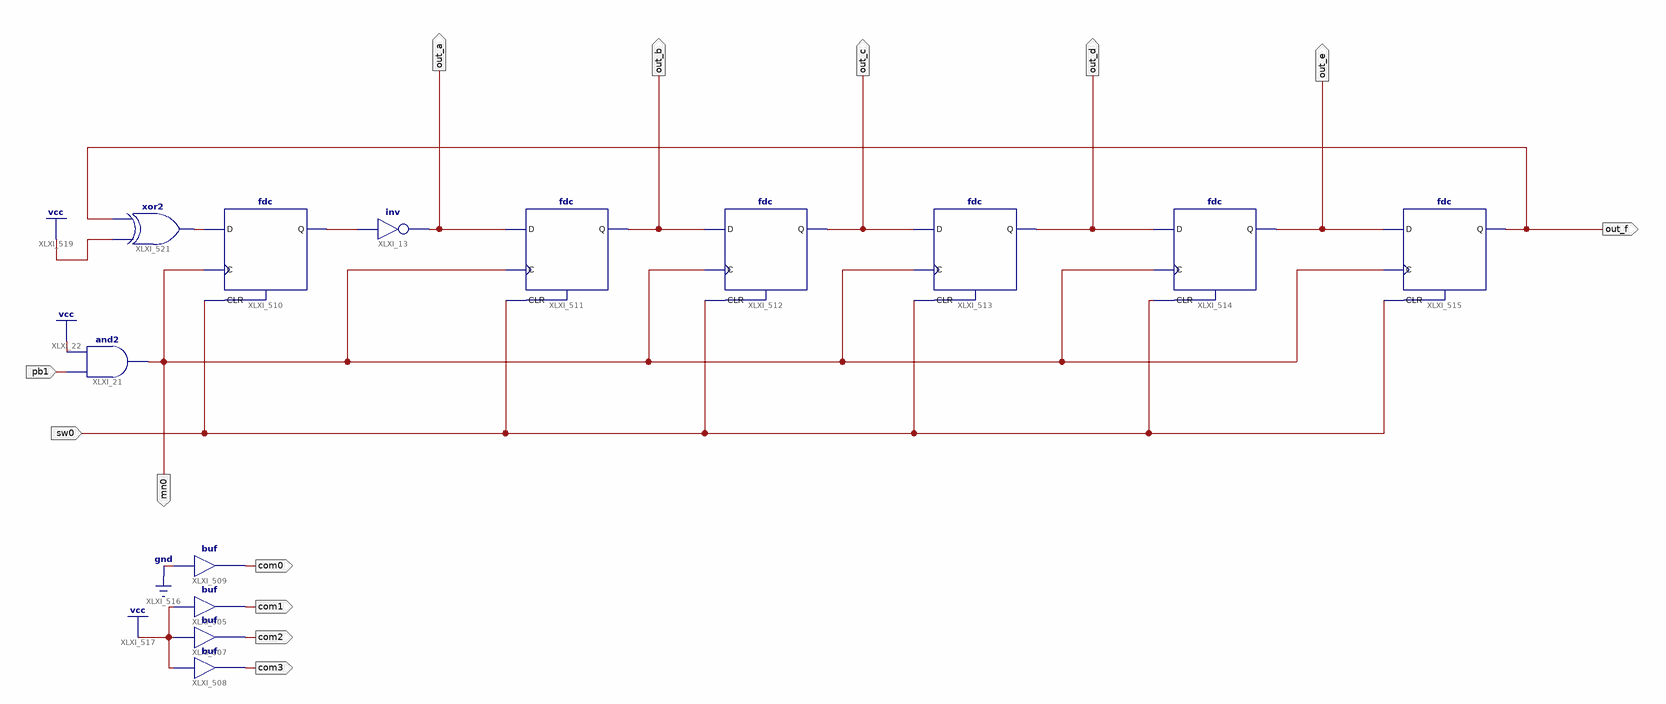
[diagram p0: schematic sheet 1]
// Xilinx ISE schematic lab705.sch (spartan6) as structural Verilog: 13 symbols, 13 ports
module lab705 (
  input  sw0,
  input  pb1,
  output out_a,
  output out_b,
  output out_c,
  output out_d,
  output out_e,
  output out_f,
  output mn0,
  output com1,
  output com2,
  output com3,
  output com0
);

  wire XLXN_2, XLXN_10;

  not XLXI_13 (out_a, XLXN_2);
  and XLXI_21 (mn0, pb1, 1'b1);
  buf XLXI_505 (com1, 1'b1);
  buf XLXI_507 (com2, 1'b1);
  buf XLXI_508 (com3, 1'b1);
  buf XLXI_509 (com0, 1'b0);
  fdc XLXI_510 (.C(mn0), .CLR(sw0), .D(XLXN_10), .Q(XLXN_2));
  fdc XLXI_511 (.C(mn0), .CLR(sw0), .D(out_a), .Q(out_b));
  fdc XLXI_512 (.C(mn0), .CLR(sw0), .D(out_b), .Q(out_c));
  fdc XLXI_513 (.C(mn0), .CLR(sw0), .D(out_c), .Q(out_d));
  fdc XLXI_514 (.C(mn0), .CLR(sw0), .D(out_d), .Q(out_e));
  fdc XLXI_515 (.C(mn0), .CLR(sw0), .D(out_e), .Q(out_f));
  xor XLXI_521 (XLXN_10, 1'b1, out_f);
endmodule
